# Altium schematic sheet Main.SchDoc
size A4
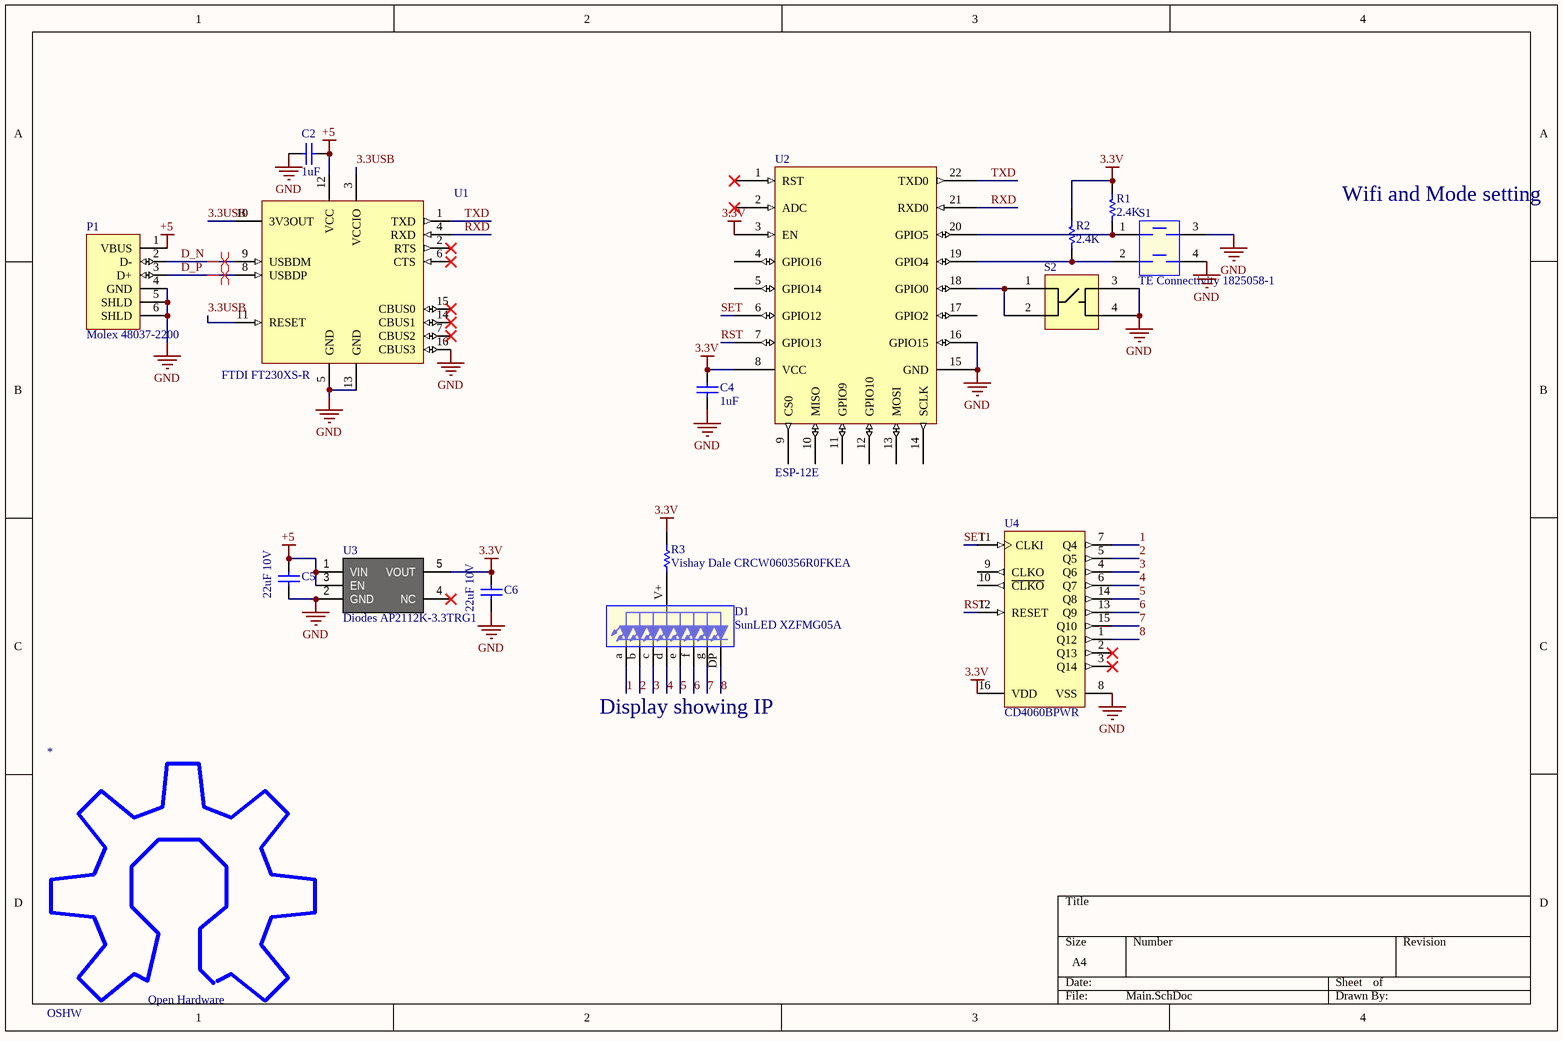
[diagram p0: Main.SchDoc]

## Parts
*  OSHW  [PCB-wvhvgo6g2u4p9maf3omu-1]
C2  1uF  [CAPC1608X90X35ML15T15]
C4  1uF  [CAPC1608X90X35ML15T15]
C5  22uF 10V  [CAPC3216X88X50NL20T25]
C6  22uF 10V  [CAPC3216X88X50NL20T25]
D1  SunLED XZFMG05A  [PCB-oie4hyh8z6kz1fe8odf0-1]
P1  Molex 48037-2200  [PCB-2v2vzbs0gio7atqgwime-1]
R1  2.4K  [RESC1608X55X25ML10T15]
R2  2.4K  [RESC1608X55X25ML10T15]
R3  Vishay Dale CRCW060356R0FKEA  [RESC1609X50X30LL10T20]
S1  TE Connectivity 1825058-1  [PCB-oate9ly85fgayrvi93ce-1]
S2  TE Connectivity (Tyco Electronics) / ALCOSWITCH FSM4JSMATR  [PCB-1274972-1]  (value not drawn)
U1  FTDI FT230XS-R  [SSOP16-0.635-5X4MM]
U2  ESP-12E  [PCB-20357682-7]
U3  Diodes AP2112K-3.3TRG1  [PCB-15095236-1]
U4  CD4060BPWR  [TI-PW16_N]

## Nets
3.3V: C4.2 C6.2 R1.2 R2.2 R3.2 U2.3(EN) U2.8(VCC) U3.5(VOUT) U4.16(VDD)
+5: C2.2 C5.2 P1.1(VBUS) U1.12(VCC) U3.1(VIN) U3.3(EN)
GND: C2.1 C4.1 C5.1 C6.1 P1.4(GND) P1.5(SHLD) P1.6(SHLD) S1.3 S1.4 S2.3 S2.4 U1.5(GND) U1.13(GND) U1.16(CBUS3) U2.15(GND) U2.16(GPIO15) U3.2(GND) U4.8(VSS)
1: D1.a U4.7(Q4)
2: D1.b U4.5(Q5)
3: D1.c U4.4(Q6)
3.3USB: U1.3(VCCIO) U1.10(3V3OUT) U1.11(RESET)
4: D1.d U4.6(Q7)
5: D1.e U4.14(Q8)
6: D1.f U4.13(Q9)
7: D1.g U4.15(Q10)
8: D1.DP U4.1(Q12)
D_N: P1.2(D-) U1.9(USBDM)
D_P: P1.3(D+) U1.8(USBDP)
RST: U2.7(GPIO13) U4.12(RESET)
RXD: U1.4(RXD) U2.21(RXD0)
SET: U2.6(GPIO12) U4.11(CLKI)
TXD: U1.1(TXD) U2.22(TXD0)
NetD1_V+: D1.V+ R3.1
NetR1_1: R1.1 S1.1 U2.20(GPIO5)
NetR2_1: R2.1 S1.2 U2.19(GPIO4)
NetS2_1: S2.1 S2.2 U2.18(GPIO0)

Not connected (* = marked no-connect by the designer): U1 2(RTS)* 6(CTS)* 7(CBUS2)* 14(CBUS1)* 15(CBUS0)*; U2 1(RST)* 2(ADC)* 4(GPIO16) 5(GPIO14) 9(CS0) 10(MISO) 11(GPIO9) 12(GPIO10) 13(MOSI) 14(SCLK) 17(GPIO2); U3 4(NC)*; U4 2(Q13)* 3(Q14)* 9(CLKO) 10(~{CLKO})

## Layout directives
differential pair: D_N, D_P

## Notes on the sheet
- (near R1) Wifi and Mode setting
- Display showing IP
- (in symbol CMP-yq9j37g916g0fiiuunoj-1) Open Hardware

## Library data of the parts
* = CMP-yq9j37g916g0fiiuunoj-1: Open Source Hardware Logo This logo indicates the piece of hardware it is found on incorporates a OSHW license and/or adheres to the definition of open source hardware found here: http://freedomdefined.org/OSHW; Homepage URL: http://freedomdefined.org/OSHW; CustomComponentID: yq9j37g916g0fiiuunoj
C2 C4 = CMP-126011-2: CAP CER 1UF 16V 10% X5R 0603; Capacitance: 1e-06 F; Dielectric Material: Ceramic Multilayer; Lead-Free Status: Lead Free; Voltage Rating (DC): 16.0 V; Capacitance Tolerance: ±10%; Case/Package: 0603; Dielectric Characteristic: X5R; Mounting Style: Surface Mount; Number of Pins: 2; Octopart Url: https://octopart.com/0603yd105kat2a-avx+interconnect+%2F+elco-46506197; OctopartID: 0bf8c0378e4bd43f; REACH SVHC Compliance: No SVHC; RoHS: Compliant; Size-Height: 0.00086 m; Size-Length: 0.0016 m; Size-Width: 0.00081 m
C5 C6 = CMP-120806-1: CAP CER 22UF 10V Y5V 1206; Manufacturer Part Number: LMK316F226ZL-T; Dynamic Catalog: M Series, High Dielectric; CiivaID: 120806; Other Names: 587-1356-2  CE LMK316 F226ZL-T; Temperature Coefficient: Y5V (F); Tolerance: -20%, +80%; Catalog Drawings: xMK Series_1206_1.6; Kits: TAIYO-HICVCAP-V1-ND  - SAMPLE KIT HI CAP VALUE CERM CAP; Capacitance: 22µF; Operating Temperature: -30°C ~ 85°C; Category: Capacitors; Packaging: Tape & Reel (TR); Family: Ceramic Capacitors; Thickness (Max): 0.071" (1.80mm); Size / Dimension: 0.126" L x 0.063" W (3.20mm x 1.60mm); Series: M; Ciiva URL: https://ciiva.com/part/lmk316f226zl-t-120806; Package / Case: 1206 (3216 Metric); Voltage - Rated: 10V; Applications: General Purpose; Mounting Type: Surface Mount, MLCC; Standard Package: 2,000
D1 = CMP-790ab255a53aa6cd-2: Display Led 0.2" Green Ca Smd; Octopart URL: http://octopart.com/xzfmg05a-sunled-39188822; OctopartID: 790ab255a53aa6cd; Manufacturer Part Number: XZFMG05A
P1 = CMP-d9a510daebca0662-1: Conn.; Data; USB; Plug; Shielded; Type A; Rt. Angle; SMT; Gold Plating; Number of Contacts: 4; Current Rating: 1.5 A; Gender: Male; Contact Plating: Gold; Manufacturer Part Number: 48037-2200; Number of Rows: 1; Mounting Style: Surface Mount; Contact Material: Brass; Octopart URL: http://octopart.com/48037-2200-molex-7673609; Lifecycle Status: Active; Packaging: Cut Tape (CT); Orientation: Right Angle; OctopartID: d9a510daebca0662; Number of Circuits: 4; Halogen Free Status: Low Halogen; REACH SVHC Compliance: No SVHC; RoHS: Compliant
R1 R2 = CMP-13559605-1: Res Thick Film 0603 2.4K Ohm 5% 1/10W 100ppm/C Molded SMD SMD Paper T/R; Manufacturer: Philips (Mepco); Manufacturer Part Number: RC0603JR-072K4L; Temperature Coefficient: ±100 ppm/°C; Lead Finish: Matte Tin; Rad Hard: No; Case Style: Molded; Resistance Value: 2.4 KOhm; Operating Temperature: -55 to 155 °C; Power Rating: 1/10 W; Category: Resistor Fixed Single-Surface Mount; Case Size: 0603; CiivaID: 13559605; Type: Thick Film; Ciiva URL: https://ciiva.com/part/rc0603jr-072k4l-13559605; Tolerance: 5 %
R3 = CMP-1857216-2: RES SMD 56 OHM 1% 1/10W 0603; Lead-Free Status: Lead Free; Power Rating: 0.1 W; Resistance: 56.0 Ω; Voltage Rating (DC): 75.0 V; Case/Package: 0603; Mounting Style: Surface Mount; Number of Pins: 2; Octopart Url: https://octopart.com/crcw060356r0fkea-vishay-39997822; OctopartID: 59c792af2ddf8600; REACH SVHC Compliance: No SVHC; Resistance Tolerance: ±1%; RoHS: Compliant; Size-Height: 0.00045 m; Size-Length: 0.00155 m; Size-Width: 0.00085 m
S1 = CMP-446e8fa1c71e9ba9-1: Switch DIP OFF ON SPST 2 Raised Slide 0.1A 24VDC Gull Wing 2.54mm SMD Tube; ELV Compliant: Compliant; Contact Plating: Gold, Gold over Nickel; OctopartID: 446e8fa1c71e9ba9; Mounting Style: Surface Mount; Packaging: Tube; Lifecycle Status: Active; Housing Color: Black; Contact Material: Copper Alloy; Manufacturer Part Number: 1825058-1; Octopart URL: http://octopart.com/1825058-1-te+connectivity-46507542; RoHS: Compliant; Contacts Type: SPST; Flammability Rating: UL 94 V-0
S2 = CMP-1274972-2: SWITCH TACTILE SPST-NO 0.05A 24V; Contacts Type: SPST; ELV Compliant: Compliant; Lead-Free Status: Lead Free; Contact Current Rating: 0.05 A; Contact Material: Copper Alloy; Contact Plating: Silver; Lifecycle Status: Active; Mounting Style: Surface Mount; Octopart Url: https://octopart.com/fsm4jsmatr-te+connectivity+%2F+alcoswitch-39752200; OctopartID: 00c5cb91b7abdf02; Packaging: Tape & Reel (TR); REACH SVHC Compliance: No SVHC; RoHS: Compliant
U1 = CMP-1315826-4: Interface; USB-basic UART; Number of pins CBUS: 4; tape; SSOP16; RoHS: Compliant; Packaging: Tape; Mounting Style: Surface Mount; Octopart Url: http://octopart.com/ft230xs-r-ftdi-22061505; OctopartID: 8b06435c0fa154c1; Seller Landing  Url: https://octopart-clicks.com/click/track?country=US&ak=8157f166&sig=0eeb63a&sid=5489&ppid=22061505&vpid=88166844&ct=offers; Manufacturer Part Number: FT230XS-R
U2 = CMP-20357682-9: ESP8266 WiFi Module - ESP-12E; CiivaID: 20357682; Manufacturer Part Number: ESP-12E
U3 = CMP-15095236-2: IC REG LDO 3.3V 0.6A SOT25; Lead-Free Status: Lead Free; Lifecycle Status: Not Listed by Manufacturer; Octopart Url: https://octopart.com/ap2112k-3.3trg1-diodes+inc.-30954557; OctopartID: 0ec2c6107f99d105; RoHS: Compliant
U4 = CMP-1166424-2: CMOS 14-Stage Ripple Carry Binary Counter / Divider and Oscillator, 3 to 18 V, -55 to 125 degC, 16-Pin TSSOP (PW), Green (RoHS & no Sb/Br), Tape and Reel; Clock Speed: 24000000.0 Hz; Lead-Free Status: Lead Free; Number of Bits: 10; Lifecycle Status: Active; Mounting Style: Surface Mount; Number of Pins: 16; Octopart Url: https://octopart.com/cd4060bpwr-texas+instruments-432031; OctopartID: 56389f34e4c189ff; Packaging: Cut Tape (CT); REACH SVHC Compliance: No SVHC; RoHS: Compliant